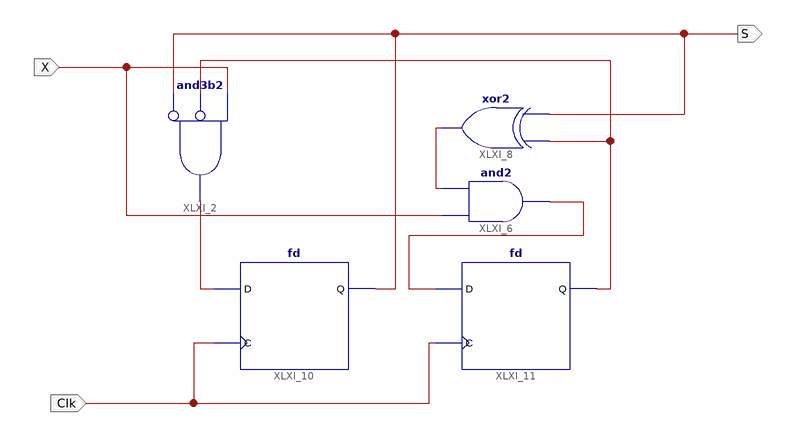
[diagram p0: schematic sheet 1]
// Xilinx ISE schematic PulseMono.sch (spartan3e) as structural Verilog: 5 symbols, 3 ports
module PulseMono (
  input  X,
  input  Clk,
  output S
);

  wire XLXN_6, XLXN_11, XLXN_13, XLXN_16;

  and XLXI_2 (XLXN_11, ~S, ~XLXN_16, X);  // and3b2
  and XLXI_6 (XLXN_13, X, XLXN_6);
  xor XLXI_8 (XLXN_6, S, XLXN_16);
  fd XLXI_10 (.C(Clk), .D(XLXN_11), .Q(S));
  fd XLXI_11 (.C(Clk), .D(XLXN_13), .Q(XLXN_16));
endmodule
